# Altium schematic sheet MotorDriver.SchDoc
size A4
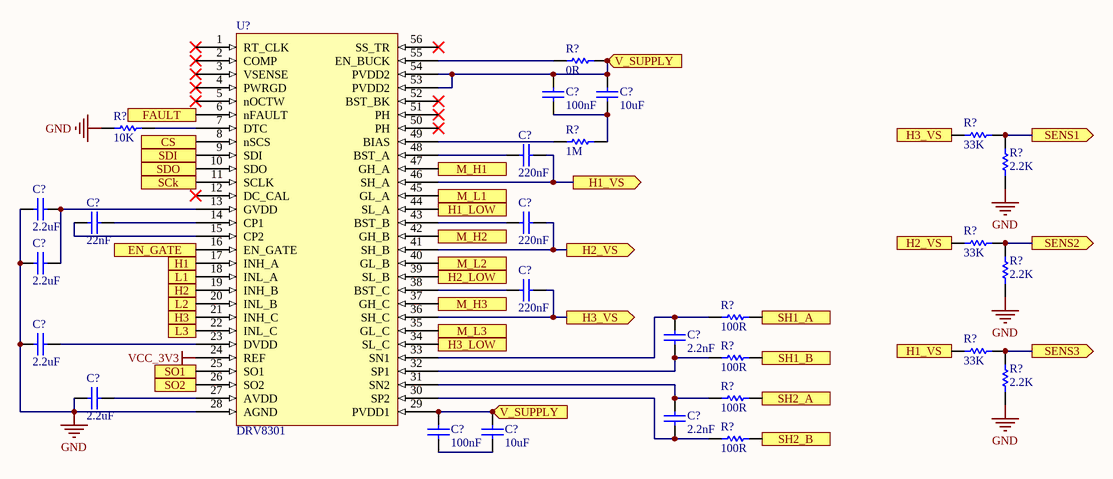
[diagram p0: MotorDriver.SchDoc]

## Parts
(Parts that share a designator on the sheet are numbered #1, #2 ... from top to bottom, then left to right.)
C?#1  100nF  [SMC_0805]
C?#2  10uF  [SMC_0805]
C?#3  220nF  [SMC_0805]
C?#4  2.2uF  [SMC_0805]
C?#5  22nF  [SMC_0805]
C?#6  220nF  [SMC_0805]
C?#7  2.2uF  [SMC_0805]
C?#8  220nF  [SMC_0805]
C?#9  2.2uF  [SMC_0805]
C?#10  2.2nF  [SMC_0402]
C?#11  2.2uF  [SMC_0805]
C?#12  2.2nF  [SMC_0402]
C?#13  100nF  [SMC_0805]
C?#14  10uF  [SMC_0805]
R?#1  0R  [SMR_0402]
R?#2  10K  [SMR_0402]
R?#3  33K  [SMR_0402]
R?#4  1M  [SMR_0402]
R?#5  2.2K  [SMR_0402]
R?#6  33K  [SMR_0402]
R?#7  2.2K  [SMR_0402]
R?#8  100R  [SMR_0402]
R?#9  33K  [SMR_0402]
R?#10  100R  [SMR_0402]
R?#11  100R  [SMR_0402]
R?#12  2.2K  [SMR_0402]
R?#13  100R  [SMR_0402]
U?  DRV8301  [TSSOP50P810X120_HS-57N]

## Ports
CS (in), EN_GATE (in), FAULT (out), H1 (in), H1_LOW (out), H1_VS (in), H1_VS (out), H2 (in), H2_LOW (out), H2_VS (in), H2_VS (out), H3 (in), H3_LOW (out), H3_VS (in), H3_VS (out), L1 (in), L2 (in), L3 (in), M_H1 (out), M_H2 (out), M_H3 (out), M_L1 (out), M_L2 (out), M_L3 (out), SCk (in), SDI (in), SDO (out), SENS1 (out), SENS2 (out), SENS3 (out), SH1_A (in), SH1_B (in), SH2_A (in), SH2_B (in), SO1 (out), SO2 (out), V_SUPPLY (in)

## Nets
GND: C?#4.2 C?#7.2 C?#9.2 C?#11.2 R?#2.1 R?#5.1 R?#7.1 R?#12.1 U?.28(AGND)
VCC_3V3: U?.24(REF)
CS: U?.8(nSCS) ; port CS
EN_GATE: U?.16(EN_GATE) ; port EN_GATE
FAULT: U?.6(nFAULT) ; port FAULT
H1: U?.17(INH_A) ; port H1
H1_LOW: U?.44(SL_A) ; port H1_LOW
H1_VS: C?#3.2 R?#9.1 U?.46(SH_A) ; port H1_VS
H2: U?.19(INH_B) ; port H2
H2_LOW: U?.39(SL_B) ; port H2_LOW
H2_VS: C?#6.2 R?#6.1 U?.41(SH_B) ; port H2_VS
H3: U?.21(INH_C) ; port H3
H3_LOW: U?.34(SL_C) ; port H3_LOW
H3_VS: C?#8.2 R?#3.1 U?.36(SH_C) ; port H3_VS
L1: U?.18(INL_A) ; port L1
L2: U?.20(INL_B) ; port L2
L3: U?.22(INL_C) ; port L3
M_H1: U?.47(GH_A) ; port M_H1
M_H2: U?.42(GH_B) ; port M_H2
M_H3: U?.37(GH_C) ; port M_H3
M_L1: U?.45(GL_A) ; port M_L1
M_L2: U?.40(GL_B) ; port M_L2
M_L3: U?.35(GL_C) ; port M_L3
SCk: U?.11(SCLK) ; port SCk
SDI: U?.9(SDI) ; port SDI
SDO: U?.10(SDO) ; port SDO
SENS1: R?#3.2 R?#5.2 ; port SENS1
SENS2: R?#6.2 R?#7.2 ; port SENS2
SENS3: R?#9.2 R?#12.2 ; port SENS3
SH1_A: R?#8.2 ; port SH1_A
SH1_B: R?#10.2 ; port SH1_B
SH2_A: R?#11.2 ; port SH2_A
SH2_B: R?#13.2 ; port SH2_B
SO1: U?.25(SO1) ; port SO1
SO2: U?.26(SO2) ; port SO2
V_SUPPLY: C?#1.2 C?#2.2 C?#13.2 C?#14.2 R?#1.2 U?.29(PVDD1) U?.53(PVDD2) U?.54(PVDD2) ; port V_SUPPLY
NetC?#1_1: C?#1.1 C?#2.1 R?#4.2
NetC?#3_1: C?#3.1 U?.48(BST_A)
NetC?#4_1: C?#4.1 C?#7.1 U?.13(GVDD)
NetC?#5_1: C?#5.1 U?.14(CP1)
NetC?#5_2: C?#5.2 U?.15(CP2)
NetC?#6_1: C?#6.1 U?.43(BST_B)
NetC?#8_1: C?#8.1 U?.38(BST_C)
NetC?#9_1: C?#9.1 U?.23(DVDD)
NetC?#10_1: C?#10.1 R?#10.1 U?.32(SP1)
NetC?#10_2: C?#10.2 R?#8.1 U?.33(SN1)
NetC?#11_1: C?#11.1 U?.27(AVDD)
NetC?#12_1: C?#12.1 R?#13.1 U?.30(SP2)
NetC?#12_2: C?#12.2 R?#11.1 U?.31(SN2)
NetC?#13_1: C?#13.1 C?#14.1
NetR?#1_1: R?#1.1 U?.55(EN_BUCK)
NetR?#2_2: R?#2.2 U?.7(DTC)
NetR?#4_1: R?#4.1 U?.49(BIAS)

Not connected (* = marked no-connect by the designer): U? 1(RT_CLK)* 2(COMP)* 3(VSENSE)* 4(PWRGD)* 5(nOCTW)* 12(DC_CAL)* 50(PH)* 51(PH)* 52(BST_BK)* 56(SS_TR)*

## Library data of the parts
C?#1-C?#14 = Cap Ceramic
R?#1-R?#13 = Res SMT